# Altium schematic sheet SCH_Display-LCD_Altium.schdoc
size 343 x 218 mm
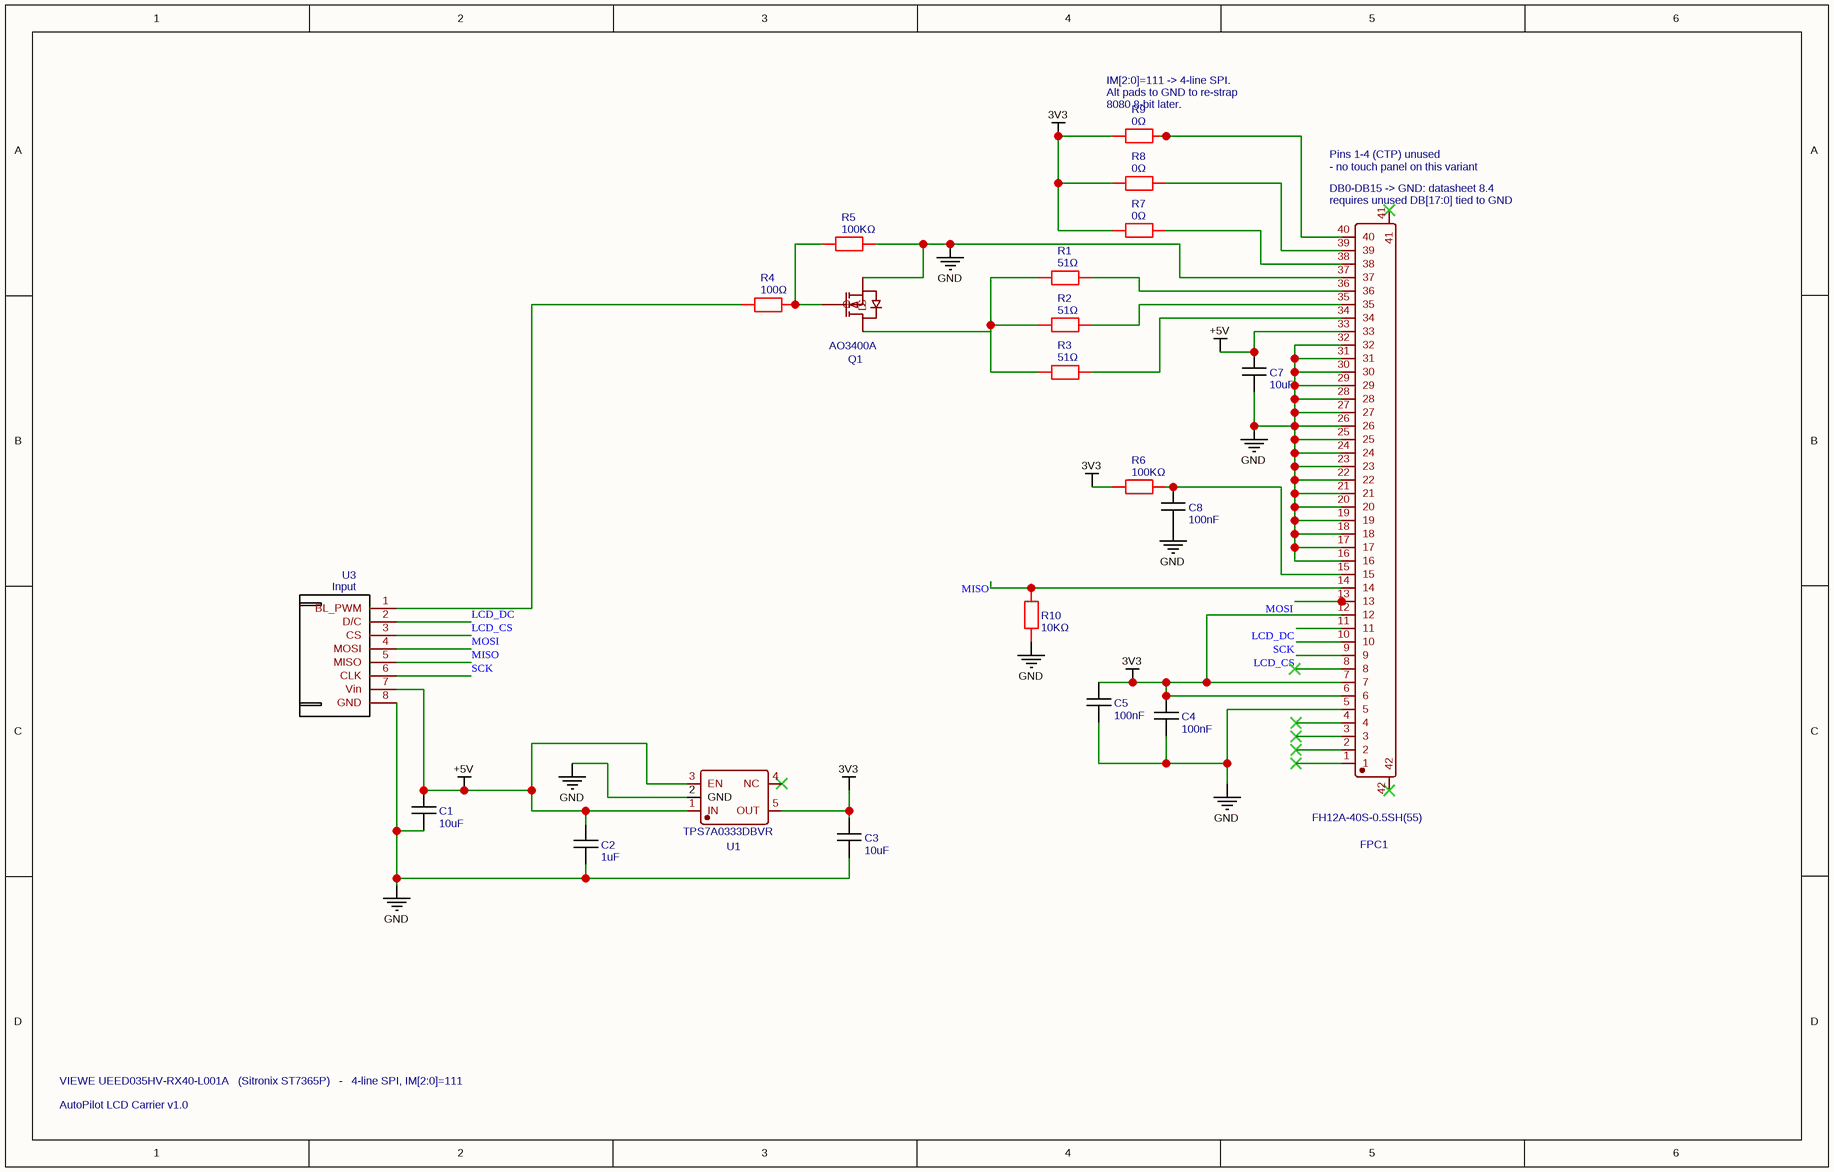
[diagram p0: SCH_Display-LCD_Altium.schdoc]

## Parts
C1  10uF  [CERAMIC CAPACITOR]
C2  1uF  [CERAMIC CAPACITOR]
C3  10uF  [CERAMIC CAPACITOR]
C4  100nF  [CERAMIC CAPACITOR]
C5  100nF  [CERAMIC CAPACITOR]
C7  10uF  [CERAMIC CAPACITOR]
C8  100nF  [CERAMIC CAPACITOR]
FPC1  FH12A-40S-0.5SH(55)  [CONN-SMD_FH12A-40S-0.5SH-55]
Q1  AO3400A  [SOT-23-3_L2.9-W1.3-P1.90-LS2.4-BR]
R1  51Ω  [1K 0.25W]
R2  51Ω  [1K 0.25W]
R3  51Ω  [1K 0.25W]
R4  100Ω  [1K 0.25W]
R5  100KΩ  [1K 0.25W]
R6  100KΩ  [1K 0.25W]
R7  0Ω  [1K 0.25W]
R8  0Ω  [1K 0.25W]
R9  0Ω  [1K 0.25W]
R10  10KΩ  [1K 0.25W]
U1  TPS7A0333DBVR  [SOT-23-5_L2.9-W1.6-P0.95-LS2.8-BR]
U3  Input  [JST-XH-8-PIN]

## Nets
3V3: C3.1 C4.1 C5.1 FPC1.6 FPC1.7 FPC1.12 R6.1 R7.1 R8.1 R9.1 U1.5(OUT)
+5V: C1.1 C2.1 C7.1 FPC1.33 U1.1(IN) U1.3(EN) U3.7(Vin)
GND: C1.2 C2.2 C3.2 C4.2 C5.2 C7.2 C8.2 FPC1.5 FPC1.16 FPC1.17 FPC1.18 FPC1.19 FPC1.20 FPC1.21 FPC1.22 FPC1.23 FPC1.24 FPC1.25 FPC1.26 FPC1.27 FPC1.28 FPC1.29 FPC1.30 FPC1.31 FPC1.32 FPC1.37 Q1.2(S) R5.2 R10.2 U1.2(GND) U3.8(GND)
LCD_CS: FPC1.9 U3.3(CS)
LCD_DC: FPC1.11 U3.2(D/C)
MISO: FPC1.14 R10.1 U3.5(MISO)
MOSI: FPC1.13 U3.4(MOSI)
SCK: FPC1.10 U3.6(CLK)
NetC8_1: C8.1 FPC1.15 R6.2
NetFPC1_34: FPC1.34 R3.2
NetFPC1_35: FPC1.35 R2.2
NetFPC1_36: FPC1.36 R1.2
NetFPC1_38: FPC1.38 R7.2
NetFPC1_39: FPC1.39 R8.2
NetFPC1_40: FPC1.40 R9.2
NetQ1_1: Q1.1(G) R4.2 R5.1
NetQ1_3: Q1.3(D) R1.1 R2.1 R3.1
NetR4_1: R4.1 U3.1(BL_PWM)

Not connected (* = marked no-connect by the designer): FPC1 1* 2* 3* 4* 8* 41* 42*; U1 4(NC)*

## Notes on the sheet
- IM[2:0]=111 -> 4-line SPI.
  Alt pads to GND to re-strap
  8080 8-bit later.
- (near FPC1) Pins 1-4 (CTP) unused
  - no touch panel on this variant
- (near FPC1) DB0-DB15 -> GND: datasheet 8.4
  requires unused DB[17:0] tied to GND
- VIEWE UEED035HV-RX40-L001A   (Sitronix ST7365P)   -   4-line SPI, IM[2:0]=111
- AutoPilot LCD Carrier v1.0

## Library data of the parts
C1 C3 C7 = 10uF: Manufacturer Part: Capacitor_Ceramic; Contributor: huuvinhz755; spicePre: C; spiceSymbolName: Capacitor_Ceramic
C2 = 1uF: Manufacturer Part: Capacitor_Ceramic; Contributor: huuvinhz755; spicePre: C; spiceSymbolName: Capacitor_Ceramic
C4 C5 C8 = 100nF: Manufacturer Part: Capacitor_Ceramic; Contributor: huuvinhz755; spicePre: C; spiceSymbolName: Capacitor_Ceramic
FPC1 = FH12A-40S-0.5SH(55): Manufacturer: HRS(广濑); Contributor: LCSC; Supplier: LCSC; Supplier Part: C506795; Manufacturer Part: FH12A-40S-0.5SH(55); JLCPCB Part Class: Extended Part; spicePre: F; spiceSymbolName: FH12A-40S-0.5SH(55)
Q1 = AO3400A: Manufacturer: AOS; Package Display: No; Supplier: LCSC; Manufacturer Part: AO3400A; Supplier Part: C20917; JLCPCB Part Class: Basic Part; spicePre: Q; spiceSymbolName: AO3400A
R1-R3 = 51Ω: Contributor: Kagutsuchi; spicePre: R; spiceSymbolName: 1w resistor
R4 = 100Ω: Contributor: Kagutsuchi; spicePre: R; spiceSymbolName: 1w resistor
R5 R6 = 100KΩ: Contributor: Kagutsuchi; spicePre: R; spiceSymbolName: 1w resistor
R7-R9 = 0Ω: Contributor: Kagutsuchi; spicePre: R; spiceSymbolName: 1w resistor
R10 = 10KΩ: Contributor: Kagutsuchi; spicePre: R; spiceSymbolName: 1w resistor
U1 = TPS7A0333DBVR: Manufacturer: TI(德州仪器); Contributor: lcsc; Supplier: LCSC; Supplier Part: C2873330; Manufacturer Part: TPS7A0333DBVR; JLCPCB Part Class: Extended Part; spicePre: U; spiceSymbolName: TPS7A0333DBVR
U3 = Input: Contributor: loyboy; Package Display: No; spicePre: U; spiceSymbolName: JST-XH-8-Pin